# Altium project PWM2PPM.PrjPcb
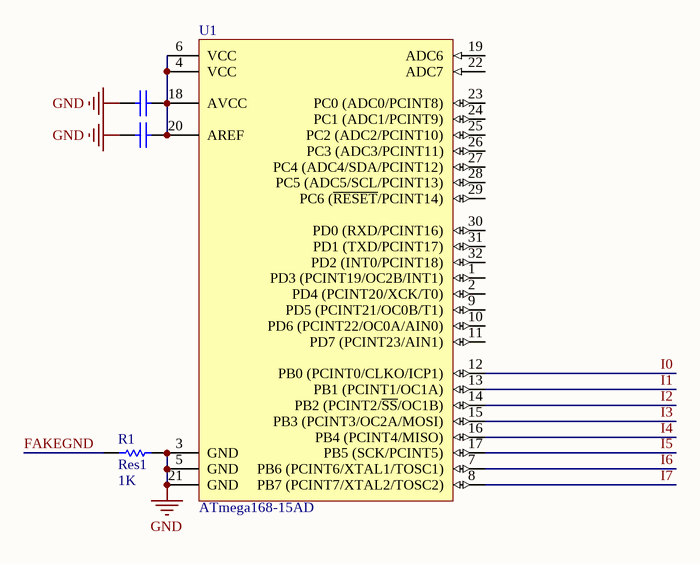
[diagram p0: sch.SchDoc]
1 sheet, 4 parts. Net scope: global (net labels, ports and power ports of the same name join across sheets).
Board file: pcb.PcbDoc

## Sheet sch.SchDoc
size A4

### Parts
C1  Cap  [0603x]  (value not drawn)
C2  Cap  [0603x]  (value not drawn)
R1  Res1  value 1K  [0603x]
U1  ATmega168-15AD  [32MA_N]

### Nets
GND: C1.2 C2.2 R1.2 U1.3(GND) U1.5(GND) U1.21(GND)
FAKEGND: R1.1
I0: U1.12(PB0_(PCINT0/CLKO/ICP1))
I1: U1.13(PB1_(PCINT1/OC1A))
I2: U1.14(PB2_(PCINT2/~{SS}/OC1B))
I3: U1.15(PB3_(PCINT3/OC2A/MOSI))
I4: U1.16(PB4_(PCINT4/MISO))
I5: U1.17(PB5_(SCK/PCINT5))
I6: U1.7(PB6_(PCINT6/XTAL1/TOSC1))
I7: U1.8(PB7_(PCINT7/XTAL2/TOSC2))
NetC1_1: C1.1 C2.1 U1.4(VCC) U1.6(VCC) U1.18(AVCC) U1.20(AREF)

Not connected (* = marked no-connect by the designer): U1 1(PD3_(PCINT19/OC2B/INT1)) 2(PD4_(PCINT20/XCK/T0)) 9(PD5_(PCINT21/OC0B/T1)) 10(PD6_(PCINT22/OC0A/AIN0)) 11(PD7_(PCINT23/AIN1)) 19(ADC6) 22(ADC7) 23(PC0_(ADC0/PCINT8)) 24(PC1_(ADC1/PCINT9)) 25(PC2_(ADC2/PCINT10)) 26(PC3_(ADC3/PCINT11)) 27(PC4_(ADC4/SDA/PCINT12)) 28(PC5_(ADC5/SCL/PCINT13)) 29(PC6_(~{RESET}/PCINT14)) 30(PD0_(RXD/PCINT16)) 31(PD1_(TXD/PCINT17)) 32(PD2_(INT0/PCINT18))

### Library data of the parts
C1 C2 = Cap: Capacitor; Value: 100pF; Published: 8-Jun-2000; LatestRevisionDate: 17-Jul-2002; LatestRevisionNote: Re-released for DXP Platform.; PackageReference: RAD-0.3; Publisher: Altium Limited; PackageDescription: Radial Cap, Thru-Hole; 2 Leads; 0.3 in Pin Spacing
R1 = Res1: Resistor; Published: 8-Jun-2000; LatestRevisionDate: 17-Jul-2002; LatestRevisionNote: Re-released for DXP Platform.; PackageReference: AXIAL-0.3; Publisher: Altium Limited; PackageDescription: Axial Device, Thru-Hole; 2 Leads; 0.3 in Pin Spacing
U1 = ATmega168-15AD: 8-bit Automotive AVR Microcontroller, 16KB Flash, 512 Bytes EEPROM, 1KB SRAM, Extended Grade (-40°C to +150°C), 32-Pin TQFP; Published: 1-Apr-2010; DatasheetVersion: revI, Feb-2010; PackageVersion: revB, Jul-2007; PackageReference: 32MA; Publisher: Altium Limited; PackageDescription: 32-Lead Thin Profile Plastic Quad Flatpack (TQFP) - 7x7x1mm Body,  0.8 mm Pitch; Supplier 1: Digi-Key; Supplier Part Number 1: ATMEGA168-15AD-ND; Supplier 2: Mouser; Supplier Part Number 2: 556-ATMEGA168-15AD; ComponentLink1Description: Manufacturer Link; ComponentLink1URL: http://www.atmel.com/products/avr/default.asp?; ComponentLink2Description: ATmega48/88/168 Datasheet; ComponentLink2URL: http://www.atmel.com/dyn/resources/prod_documents/doc7530.pdf; ComponentLink3Description: ATmega88/168 Appendix; ComponentLink3URL: http://www.atmel.com/dyn/resources/prod_documents/doc7607.pdf; ComponentLink4Description: Atmel.com Home; ComponentLink4URL: http://www.atmel.com